# EAGLE schematic accessory-harness (EAGLE 7.0.0)
Honda CTX1300AE Accessory Harness Accessory harness with relay assist, controlled by ACC wire from front option connector
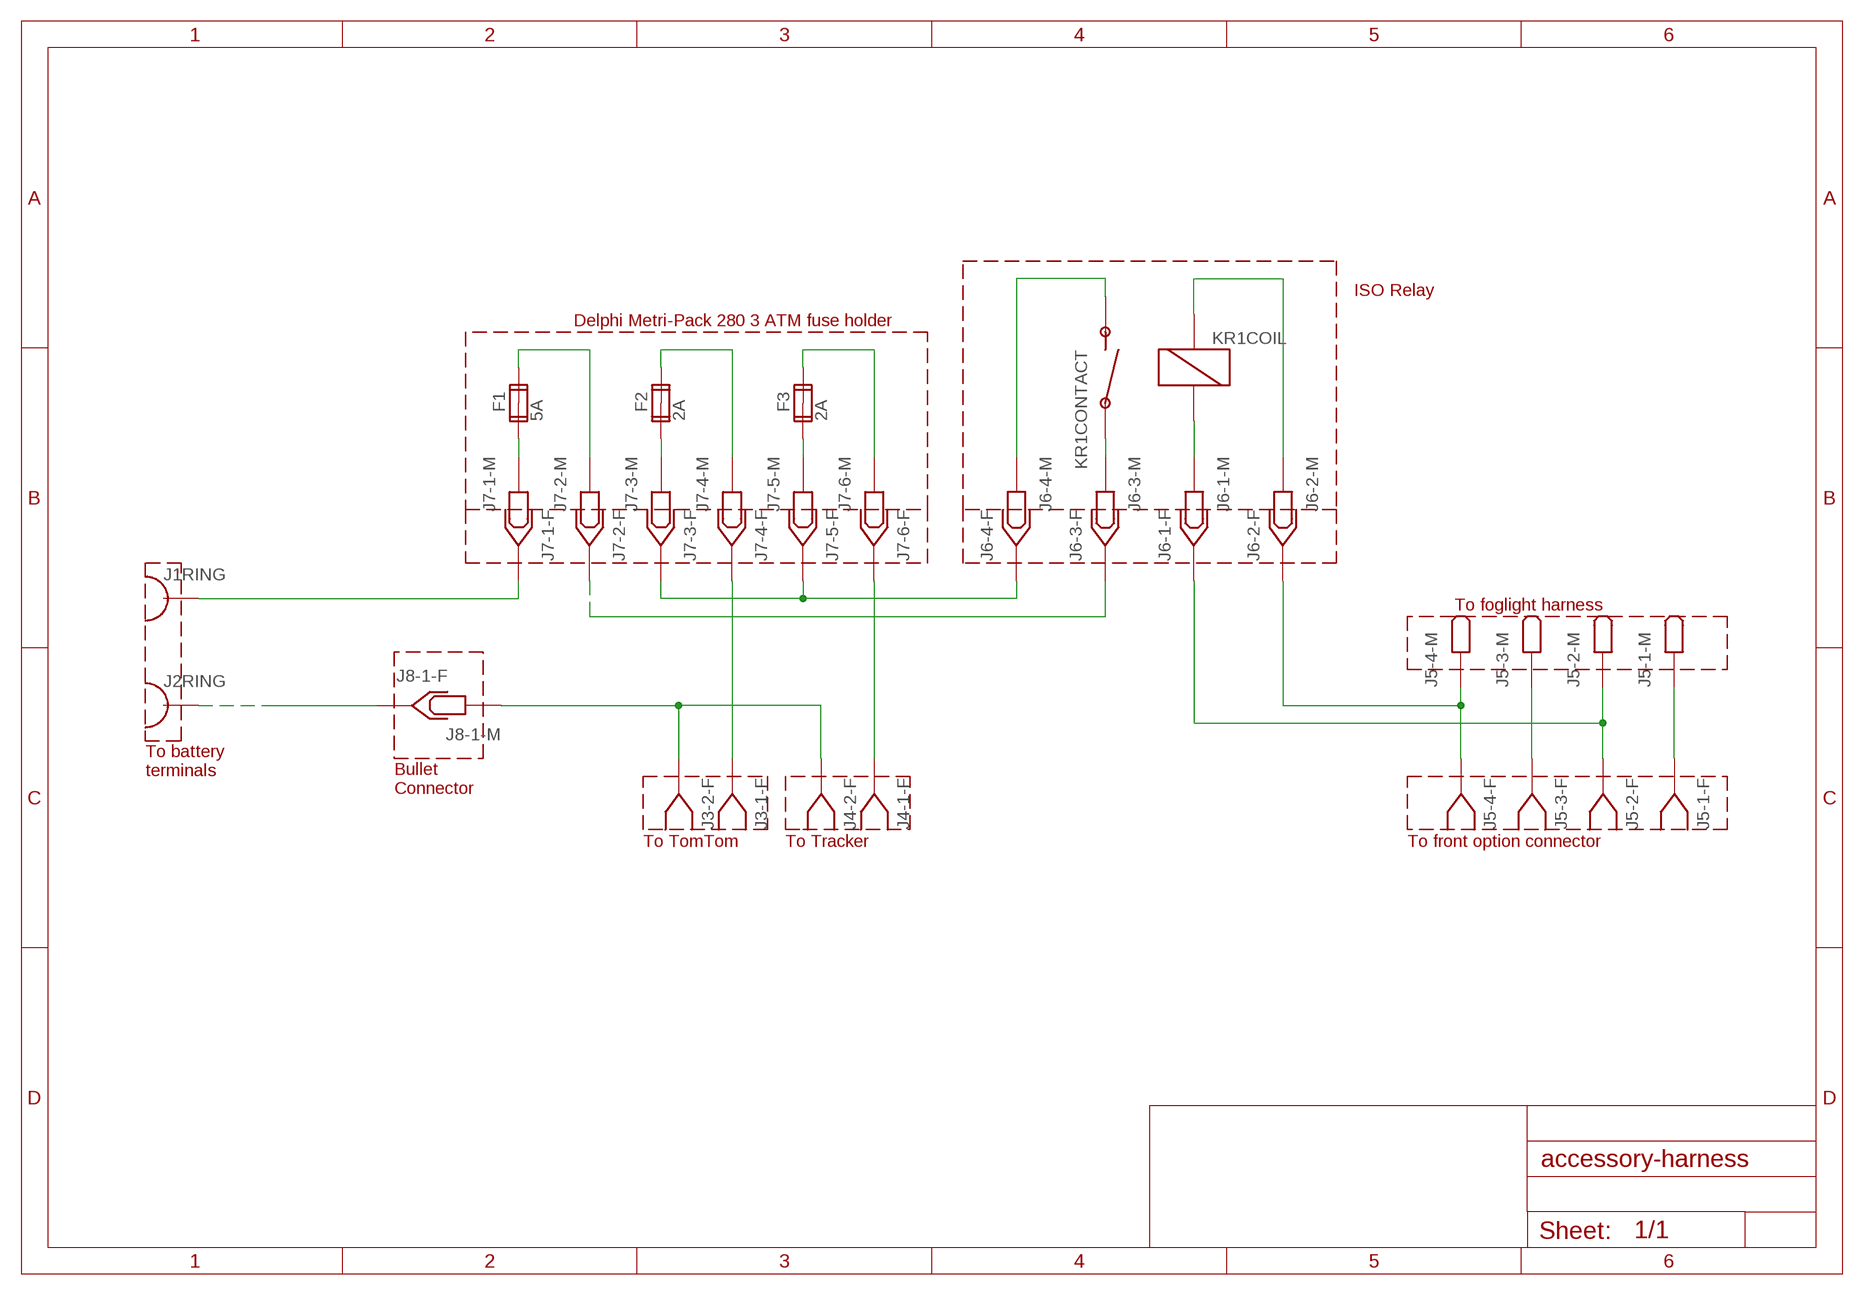
[diagram p0: schematic, sheet 1]

## Parts
F1  5A  FUSE2P  [FUSE1]
F2  2A  FUSE2P  [FUSE1]
F3  2A  FUSE2P  [FUSE1]

## Nets
P$1: F1.1A F1.2A F2.1A F2.2A F3.1A F3.2A ; supply symbol labelled SPADE_1WAY, SPADE_2WAY, SPADE_4WAY, SPADE_6WAY
Unconnected: F1.1B F1.2B F2.1B F2.2B F3.1B F3.2B

## Notes on the sheet
- ISO Relay
- Delphi Metri-Pack 280 3 ATM fuse holder
- To foglight harness
- To battery
  terminals
- Bullet
  Connector
- To TomTom | To Tracker | To front option connector

## Library data of the parts
F1-F3 = special:FUSE2P: FUSE 5 x 20 mm